# Altium schematic sheet NNLightSwitcher_charge.SchDoc
size A4
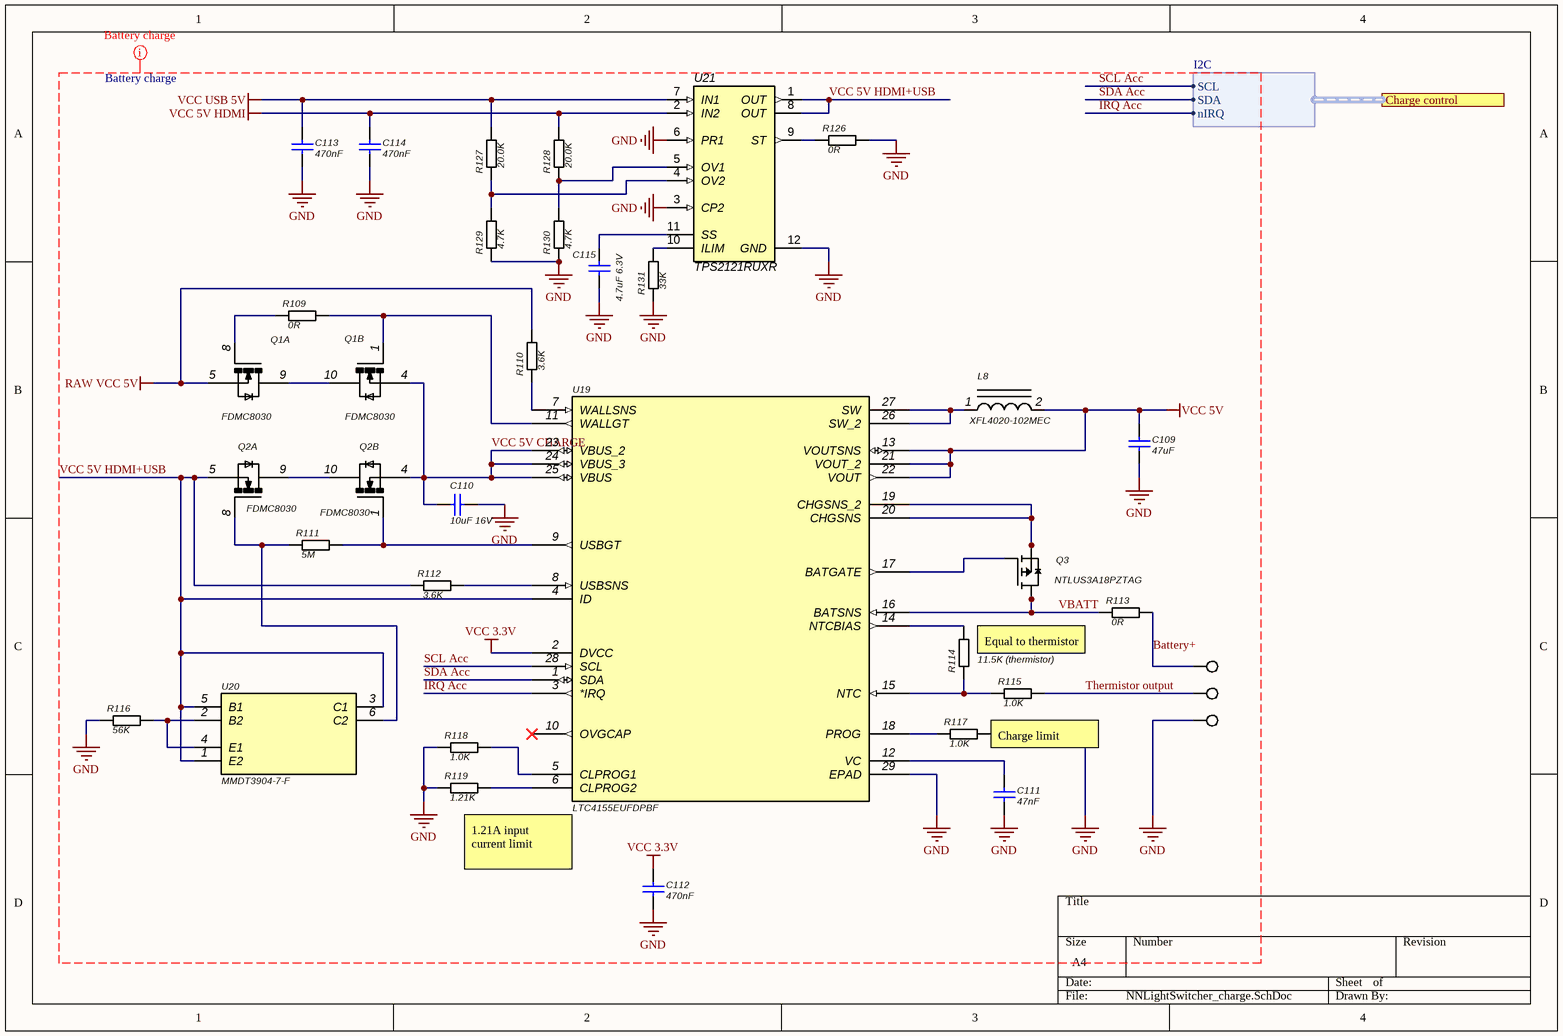
[diagram p0: NNLightSwitcher_charge.SchDoc]

## Parts
C109  47uF  [Res_0805]
C110  10uF 16V  [*0603]
C111  47nF  [0402]
C112  470nF  [0402]
C113  470nF  [0402]
C114  470nF  [0402]
C115  4.7uF 6.3V  [*0603]
L8  XFL4020-102MEC  [*INDM4040X210]
Q1  FDMC8030  [*TRANS_FDMC8030]  (parts A,B of 2)
Q2  FDMC8030  [*TRANS_FDMC8030]  (parts A,B of 2)
Q3  NTLUS3A18PZTAG  [*TRANS_NTLUS3A18PZTAG]
R109  0R  [0402]
R110  3.6K  [0402]
R111  5M  [0402]
R112  3.6K  [0402]
R113  0R  [0402]
R114  11.5K (thermistor)  [0402]
R115  1.0K  [0402]
R116  56K  [0402]
R117  1.0K  [0402]
R118  1.0K  [0402]
R119  1.21K  [0402]
R126  0R  [0402]
R127  20.0K  [0402]
R128  20.0K  [0402]
R129  4.7K  [0402]
R130  4.7K  [0402]
R131  33K  [0402]
TP60  Test point  [Connection]  (value not drawn)
TP61  Test point  [Connection]  (value not drawn)
TP62  Test point  [Connection]  (value not drawn)
U19  LTC4155EUFDPBF  [*QFN-28_UFD]
U20  MMDT3904-7-F  [*SOT65P210X110-6N]
U21  TPS2121RUXR  [*IC_TPS2121RUXR_TPS2121RUXR(Primary)]

## Ports
Charge control (harness I2C)

## Harnesses
I2C: SDA, SCL, nIRQ

## Nets
GND: C109.2 C110.1 C111.2 C112.2 C113.2 C114.2 C115.2 R116.1 R117.2 R118.1 R119.1 R126.2 R129.1 R130.1 R131.1 TP62.1 U19.29(EPAD) U21.3(CP2) U21.6(PR1) U21.12(GND)
RAW VCC 5V: Q1.5(S2) R110.2
VCC 3.3V: C112.1 U19.2(DVCC)
VCC 5V: C109.1 L8.2 U19.13(VOUTSNS) U19.21(VOUT_2) U19.22(VOUT)
VCC 5V HDMI: C114.1 R128.2 U21.2(IN2)
VCC USB 5V: C113.1 R127.2 U21.7(IN1)
Battery+: R113.2 TP60.1
IRQ Acc: U19.3(*IRQ) ; port Charge control.nIRQ
SCL Acc: U19.28(SCL) ; port Charge control.SCL
SDA Acc: U19.1(SDA) ; port Charge control.SDA
Thermistor output: R115.2 TP61.1
VBATT: Q3.1(D) Q3.2(D) Q3.5(D) Q3.6(D) Q3.7(D) R113.1 U19.16(BATSNS)
VCC 5V CHARGE: C110.2 Q1.4(S1) Q2.4(S1) U19.23(VBUS_2) U19.24(VBUS_3) U19.25(VBUS)
VCC 5V HDMI+USB: Q2.5(S2) R112.1 U19.4(ID) U20.1(E2) U20.3(C1) U20.5(B1) U21.1(OUT) U21.8(OUT)
NetC111_1: C111.1 U19.12(VC)
NetC115_1: C115.1 U21.11(SS)
NetL8_1: L8.1 U19.26(SW_2) U19.27(SW)
NetQ1_1: Q1.1(G1) R109.2 U19.11(WALLGT)
NetQ1_8: Q1.8(G2) R109.1
NetQ1_9: Q1.9(D2) Q1.10(D1)
NetQ2_1: Q2.1(G1) R111.2 U19.9(USBGT)
NetQ2_8: Q2.8(G2) R111.1 U20.6(C2)
NetQ2_9: Q2.9(D2) Q2.10(D1)
NetQ3_3: Q3.3(G) U19.17(BATGATE)
NetQ3_4: Q3.4(S) Q3.8(S) U19.19(CHGSNS_2) U19.20(CHGSNS)
NetR110_1: R110.1 U19.7(WALLSNS)
NetR112_2: R112.2 U19.8(USBSNS)
NetR114_1: R114.1 R115.1 U19.15(NTC)
NetR114_2: R114.2 U19.14(NTCBIAS)
NetR116_2: R116.2 U20.2(B2) U20.4(E1)
NetR117_1: R117.1 U19.18(PROG)
NetR118_2: R118.2 U19.5(CLPROG1)
NetR119_2: R119.2 U19.6(CLPROG2)
NetR126_1: R126.1 U21.9(ST)
NetR127_1: R127.1 R129.2 U21.4(OV2)
NetR128_1: R128.1 R130.2 U21.5(OV1)
NetR131_2: R131.2 U21.10(ILIM)

Not connected (* = marked no-connect by the designer): U19 10(OVGCAP)*

## Layout directives
net class Battery charge: Battery+, GND, IRQ Acc, RAW VCC 5V, SCL Acc, SDA Acc, Thermistor output, VBATT, VCC 3.3V, VCC 5V, VCC 5V CHARGE, VCC 5V HDMI, VCC 5V HDMI+USB, VCC USB 5V

## Notes on the sheet
- Current limit
  RILM = 18.7kΩ 5.2A
  RILM = 22.1kΩ 4.5 A
  RILM = 29.8kΩ 3.5 A
  RILM = 44.2kΩ 2.5 A
  RILM = 80kΩ 1.5 A
  RILM < 1kΩ 2.5A
- (near R114) Equal to thermistor
- (near R117) Charge limit
- 1.21A input current limit

## Library data of the parts
C109 = Capacitor 47uF: ComponentLink1Description: Datasheet link; ComponentLink1URL: http://www.yageo.com/documents/recent/UPY-GP_NP0_16V-to-50V_16.pdf
C110 = Capacitor 10uF 16V: EMK107BBJ106MA-T; Manufacturer 1: Taiyo Yuden; Tolerance: 20%; Dielectric: X5R; ComponentLink1Description: Datasheet link; ComponentLink1URL: http://www.yageo.com/documents/recent/UPY-GP_NP0_16V-to-50V_16.pdf; Supplier 1: Digi-Key; Manufacturer Part Number 1: EMK107BBJ106MA-T; Stock 1: 576511; Pricing 1: 1=0,44000, 10=0,30600, 100=0,18370, 500=0,13778, 1000=0,11635 (USD); RoHS: Yes; Mount: Surface Mount; Case/Package: 0603; Case Code (Metric): 1608; Case Code (Imperial): 0603; Min Operating Temperature: -55°C; Max Operating Temperature: 85°C; Capacitance: 10uF; Packaging: Tape and Reel; Voltage Rating: 16V; Package Quantity: 1; Termination: SMD/SMT; Voltage Rating (DC): 16V; Length: 0.063inch; Height: 0.8mm; Width: 0.031inch; Thickness: 0.031inch; REACH SVHC: Unknown; Halogen Free: Halogen Free; ComponentLink2URL: https://datasheet.ciiva.com/6259/emk107bbj106ma-t-6259169.pdf?src-supplier=Digi-Key; ComponentLink2Description: https://datasheet.ciiva.com/6259/emk107bbj106ma-t-6259169.pdf?src-supplier=Digi-Key; ComponentLink3URL: https://datasheet.ciiva.com/15920/3emk107bbj106ma-t-15920482.pdf?src-supplier=Onlinecomponents.com; ComponentLink3Description: https://datasheet.ciiva.com/15920/3emk107bbj106ma-t-15920482.pdf?src-supplier=Onlinecomponents.com; ComponentLink4URL: https://datasheet.ciiva.com/34372/463emk107bbj106ma-t-34372674.pdf?src-supplier=Onlinecomponents.com; ComponentLink4Description: https://datasheet.ciiva.com/34372/463emk107bbj106ma-t-34372674.pdf?src-supplier=Onlinecomponents.com; ComponentLink5URL: https://datasheet.ciiva.com/6259/emk107bbj106ma-t-6259164.pdf?src-supplier=Digi-Key; ComponentLink5Description: https://datasheet.ciiva.com/6259/emk107bbj106ma-t-6259164.pdf?src-supplier=Digi-Key; ComponentLink6URL: https://datasheet.ciiva.com/6259/emk107bbj106ma-t-6259167.pdf?src-supplier=Digi-Key; ComponentLink6Description: https://datasheet.ciiva.com/6259/emk107bbj106ma-t-6259167.pdf?src-supplier=Digi-Key; ComponentLink7URL: https://datasheet.ciiva.com/13168/mlcc01-e-13168735.pdf?src-supplier=Mouser; ComponentLink7Description: https://datasheet.ciiva.com/13168/mlcc01-e-13168735.pdf?src-supplier=Mouser
C111 = Capacitor 47nF: ComponentLink1Description: Datasheet link; ComponentLink1URL: http://www.yageo.com/documents/recent/UPY-GP_NP0_16V-to-50V_16.pdf
C112-C114 = Capacitor 470nF: ComponentLink1Description: Datasheet link; ComponentLink1URL: http://www.yageo.com/documents/recent/UPY-GP_NP0_16V-to-50V_16.pdf
C115 = Capacitor 4.7uF 6.3V: ComponentLink1Description: Datasheet link; ComponentLink1URL: http://www.yageo.com/documents/recent/UPY-GP_NP0_16V-to-50V_16.pdf
L8 = XFL4020-102MEC: Power inductor, shielded, 20% tol, SMT, RoHS, halogen free; Manufacturer 1: Coilcraft; Core Material: Composite; DC Resistance (DCR): 11.9mR; Inductance: 1uH; Max DC Current: 11A; Saturation Current: 4.5A; Self Resonant Frequency: 64MHz; Test Frequency: 100kHz; Value: *; Case/Package: SMD/SMT; ComponentLink1Description: https://datasheet.ciiva.com/22679/1682010-22679273.pdf?src-supplier=Element14; ComponentLink1URL: https://datasheet.ciiva.com/22679/1682010-22679273.pdf?src-supplier=Element14; ComponentLink2Description: https://datasheet.ciiva.com/22679/1682010-22679274.pdf?src-supplier=Element14; ComponentLink2URL: https://datasheet.ciiva.com/22679/1682010-22679274.pdf?src-supplier=Element14; ComponentLink3Description: https://datasheet.ciiva.com/13168/xfl4020-13168079.pdf?src-supplier=Mouser; ComponentLink3URL: https://datasheet.ciiva.com/13168/xfl4020-13168079.pdf?src-supplier=Mouser; Height: 2.1mm; Inductance Tolerance: 20%; Lead Free: Contains Lead; Length: 4.3mm; Manufacturer Part Number 1: XFL4020-102MEC; Max Operating Temperature: 125°C; Min Operating Temperature: -40°C; Mount: Surface Mount; Packaging: Tape and Reel; Pricing 1: 1=2,13000, 10=2,13000, 50=1,85000, 100=1,55000, 500=0,96000, 1000=0,88400, 2000=0,82300, 10000=0,82300 (USD); REACH SVHC: No SVHC; RMS Current (Irms): 11A; RoHS: Yes; Shielding: Shielded; Stock 1: 16834; Supplier 1: Mouser; Supplier Part Number 1: 994-XFL4020-102MEC; Termination: SMD/SMT; Tolerance: 20%; Width: 4.3mm
Q1 Q2 = FDMC8030: Mosfet Array 2 N-Channel (Dual) 40V 12A 800mW Surface Mount 8-Power33 (3x3); Manufacturer 1: ON Semiconductor / Fairchild; Drain to Source Resistance: 10mR; Fall Time: 3ns; Gate to Source Voltage (Vgs): 12V; Input Capacitance: 1.975nF; Number of Elements: 1; Turn-Off Delay Time: 19ns; Turn-On Delay Time: 7ns; Value: *; ComponentLink1Description: https://datasheet.ciiva.com/11175/fdmc8030-11175489.pdf?src-supplier=Avnet; ComponentLink1URL: https://datasheet.ciiva.com/11175/fdmc8030-11175489.pdf?src-supplier=Avnet; ComponentLink2Description: https://datasheet.ciiva.com/4439/fdmc8030-103806-4439986.pdf?src-supplier=Mouser; ComponentLink2URL: https://datasheet.ciiva.com/4439/fdmc8030-103806-4439986.pdf?src-supplier=Mouser; ComponentLink3Description: https://datasheet.ciiva.com/15044/fdmc8030-15044346.pdf?src-supplier=Digi-Key; ComponentLink3URL: https://datasheet.ciiva.com/15044/fdmc8030-15044346.pdf?src-supplier=Digi-Key; Continuous Drain Current (ID): 12A; Drain to Source Breakdown Voltage: 40V; Drain to Source Voltage (Vdss): 40V; Element Configuration: Dual; FET Type: 2 N-Channel; Height: 0.75mm; Length: 3mm; Manufacturer Part Number 1: FDMC8030; Max Operating Temperature: 150°C; Max Power Dissipation: 800mW; Min Operating Temperature: -55°C; Mount: Surface Mount; Number of Pins: 8; Package Quantity: 3000; Packaging: Tape and Reel; Power Dissipation: 800mW; Pricing 1: 1=0,85000, 10=0,72800, 50=0,72800, 100=0,56000, 500=0,49500, 1000=0,39000, 3000=0,34600, 9000=0,33300, 10000=0,33300, 24000=0,32300, 45000=0,31300 (USD); Radiation Hardening: No; Rds On Max: 10mR; Rise Time: 3ns; RoHS: Yes; Stock 1: 20975; Supplier 1: Mouser; Supplier Part Number 1: 512-FDMC8030; Weight: 0.196g; Width: 3mm
Q3 = NTLUS3A18PZTAG: Power MOSFET -20V -8.2A 18 mOhm Single P-Channel UDFN6 with ESD Protection; Manufacturer 1: ON Semiconductor; Continuous Drain Current (ID): 8.2A; Drain to Source Resistance: 90mR; Drain to Source Voltage (Vdss): 20V; Fall Time: 88ns; Gate to Source Voltage (Vgs): 8V; Input Capacitance: 2.24nF; Max Power Dissipation: 700mW; Number of Elements: 1; Power Dissipation: 1.7W; Rds On Max: 18mR; Rise Time: 15ns; Turn-Off Delay Time: 150ns; Turn-On Delay Time: 8.6ns; Value: *; ComponentLink1Description: https://datasheet.ciiva.com/13052/ntlus3a18pz-d-89517-13052585.pdf?src-supplier=Mouser; ComponentLink1URL: https://datasheet.ciiva.com/13052/ntlus3a18pz-d-89517-13052585.pdf?src-supplier=Mouser; ComponentLink2Description: https://datasheet.ciiva.com/11166/ntlus3a18pz-d-11166499.pdf?src-supplier=Avnet; ComponentLink2URL: https://datasheet.ciiva.com/11166/ntlus3a18pz-d-11166499.pdf?src-supplier=Avnet; ComponentLink3Description: https://datasheet.ciiva.com/6374/ntlus3a18pz-d-6374085.pdf?src-supplier=Digi-Key; ComponentLink3URL: https://datasheet.ciiva.com/6374/ntlus3a18pz-d-6374085.pdf?src-supplier=Digi-Key; ComponentLink4Description: https://datasheet.ciiva.com/30480/0900766b81267308-30480122.pdf?src-supplier=RSComponents; ComponentLink4URL: https://datasheet.ciiva.com/30480/0900766b81267308-30480122.pdf?src-supplier=RSComponents; Contact Plating: Tin,Matte; Drain to Source Breakdown Voltage: -20V; Element Configuration: Single; Height: 0.5mm; Lead Free: Lead Free; Length: 2mm; Manufacturer 2: ON Semiconductor; Manufacturer Part Number 1: NTLUS3A18PZTAG; Manufacturer Part Number 2: NTLUS3A18PZTAG; Max Operating Temperature: 150°C; Min Operating Temperature: -55°C; Number of Pins: 6; Package Quantity: 3000; Packaging: Tape and Reel; Pricing 1: 1=0,61000, 10=0,53500, 100=0,41040, 500=0,32446, 1000=0,25956 (USD); Pricing 2: 1=0,56000, 10=0,46500, 50=0,46500, 100=0,30000, 1000=0,24000, 10000=0,19600 (USD); Radiation Hardening: No; RoHS: Yes; Stock 1: 1739; Stock 2: 5542; Supplier 1: Digi-Key; Supplier 2: Mouser; Supplier Part Number 1: NTLUS3A18PZTAGOSCT-ND; Supplier Part Number 2: 863-NTLUS3A18PZTAG; Width: 2mm
R109 R111 R113 R126 = Resistor 0R
R110 R112 = Resistor 3.6K
R114 = Resistor 11.5K
R115 R117 R118 = Resistor 1.0K
R116 = Resistor 56K
R119 = Resistor 1.21K
R127 R128 = Resistor 20.0K
R129 R130 = Resistor 4.7K
R131 = Resistor 33K
TP60-TP62 = Test point: Test Point, Miniature, SMT; ComponentLink1Description: Datasheet URL; ComponentLink1URL: http://www.keyelco.com/userAssets/store/files/5015.PDF
U19 = LTC4155EUFDPBF: LTC4155 - Dual Input Power Manager/ 3.5A Li-Ion Battery Charger with I2C Control and USB OTG; Manufacturer 1: Analog Devices / Linear Technology; Manufacturer Part Number 1: LTC4155EUFD#PBF; Max Input Voltage: 5.5V; Min Input Voltage: 4.35V; Number of Cells: 1; Number of Outputs: 2; Value: *; Case/Package: QFN; ComponentLink1Description: https://datasheet.ciiva.com/1140/1712322-1140048.pdf?src-supplier=Farnell; ComponentLink1URL: https://datasheet.ciiva.com/1140/1712322-1140048.pdf?src-supplier=Farnell; ComponentLink2Description: https://datasheet.ciiva.com/1145/1563219-1145027.pdf?src-supplier=Newark; ComponentLink2URL: https://datasheet.ciiva.com/1145/1563219-1145027.pdf?src-supplier=Newark; ComponentLink3Description: https://datasheet.ciiva.com/15114/getdatasheetpartid-472825-15114764.pdf?src-supplier=Verical; ComponentLink3URL: https://datasheet.ciiva.com/15114/getdatasheetpartid-472825-15114764.pdf?src-supplier=Verical; ComponentLink4Description: https://datasheet.ciiva.com/1137/1712322-1137501.pdf?src-supplier=Element14; ComponentLink4URL: https://datasheet.ciiva.com/1137/1712322-1137501.pdf?src-supplier=Element14; ComponentLink5Description: https://datasheet.ciiva.com/1934/39952-1934203.pdf?src-supplier=Digi-Key; ComponentLink5URL: https://datasheet.ciiva.com/1934/39952-1934203.pdf?src-supplier=Digi-Key; Lead Free: Lead Free; Length: 5mm; Max Charge Current: 3.5A; Max Operating Temperature: 125°C; Max Supply Voltage: 5.5V; Min Operating Temperature: -40°C; Min Supply Voltage: 4.35V; Number of Pins: 28; Output Voltage: 4.35V; Package Quantity: 73; Packaging: Rail/Tube; Pricing 1: 1=7,14000, 25=4,74080, 100=3,92000, 250=3,72400, 500=3,64000 (USD); Radiation Hardening: No; REACH SVHC: No SVHC; RoHS: Yes; Stock 1: 2605; Supplier 1: Digi-Key; Supplier Part Number 1: LTC4155EUFD#PBF-ND
U20 = MMDT3904-7-F: TRANSISTOR, ARRAY, DUAL NPN, 40V, 200mA, SOT-363-6, FULL REEL; Manufacturer 1: Diodes; Collector Base Voltage (VCBO): 60V; Collector Emitter Saturation Voltage: 300mV; Emitter Base Voltage (VEBO): 6V; Frequency: 300MHz; hFE Min: 100; Max Power Dissipation: 200mW; Number of Elements: 2; Turn-Off Delay Time: 250ns; Turn-On Delay Time: 70ns; Value: *; Case/Package: SOT-363; Collector Emitter Breakdown Voltage: 40V; Collector Emitter Voltage (VCEO): 40V; ComponentLink1Description: https://datasheet.ciiva.com/11198/ds30088-11198646.pdf?src-supplier=Avnet; ComponentLink1URL: https://datasheet.ciiva.com/11198/ds30088-11198646.pdf?src-supplier=Avnet; ComponentLink2Description: https://datasheet.ciiva.com/15138/getdatasheetpartid-35717-15138590.pdf?src-supplier=Verical; ComponentLink2URL: https://datasheet.ciiva.com/15138/getdatasheetpartid-35717-15138590.pdf?src-supplier=Verical; ComponentLink3Description: https://datasheet.ciiva.com/34302/1591025-34302607.pdf?src-supplier=Jameco; ComponentLink3URL: https://datasheet.ciiva.com/34302/1591025-34302607.pdf?src-supplier=Jameco; ComponentLink4Description: https://datasheet.ciiva.com/4723/ds30088-4723579.pdf?src-supplier=Mouser; ComponentLink4URL: https://datasheet.ciiva.com/4723/ds30088-4723579.pdf?src-supplier=Mouser; ComponentLink5Description: https://datasheet.ciiva.com/8029/ds30088-8029724.pdf?src-supplier=Element14; ComponentLink5URL: https://datasheet.ciiva.com/8029/ds30088-8029724.pdf?src-supplier=Element14; ComponentLink6Description: https://datasheet.ciiva.com/11207/ds30088-11207885.pdf?src-supplier=Avnet; ComponentLink6URL: https://datasheet.ciiva.com/11207/ds30088-11207885.pdf?src-supplier=Avnet; Continuous Collector Current: 200mA; Current Rating: 200mA; Element Configuration: Dual; Gain Bandwidth Product: 300MHz; Height: 1mm; Lead Free: Lead Free; Length: 2.2mm; Manufacturer 2: Diodes; Manufacturer Part Number 1: MMDT3904-7-F; Manufacturer Part Number 2: MMDT3904-7-F; Max Breakdown Voltage: 40V; Max Collector Current: 200mA; Max Frequency: 300MHz; Max Operating Temperature: 150°C; Min Operating Temperature: -55°C; Mount: Surface Mount; Number of Pins: 6; Number of Terminals: 6; Package Quantity: 1; Packaging: Tape and Reel; Polarity: NPN; Power Dissipation: 200mW; Pricing 1: 1=0,28000, 10=0,23300, 100=0,12330, 500=0,08112, 1000=0,05516 (USD); Pricing 2: 1=0,36000, 10=0,25500, 50=0,25500, 100=0,11800, 1000=0,09000, 3000=0,07700, 9000=0,07000, 10000=0,07000, 24000=0,06600 (USD); Radiation Hardening: No; REACH SVHC: No SVHC; RoHS: Yes; Stock 1: 128767; Stock 2: 36237; Supplier 1: Digi-Key; Supplier 2: Mouser; Supplier Part Number 1: MMDT3904-FDICT-ND; Supplier Part Number 2: 621-MMDT3904-F; Transition Frequency: 300MHz; Voltage Rating (DC): 40V; Weight: 0.000212oz; Width: 1.35mm
U21 = TPS2121RUXR: PWR MGMT BATTERY MGMT; MF: Texas Instruments; MP: TPS2121RUXR; Package: VFQFN-12 Texas Instruments; SnapEDA_Link: https://www.snapeda.com/parts/TPS2121RUXR/Texas%20Instruments/view-part/?ref=snap; Availability: Unavailable; Price: None; Value: *